# Altium schematic sheet Main_Schematic.SchDoc
size D; SheetTitle: Sheet Title
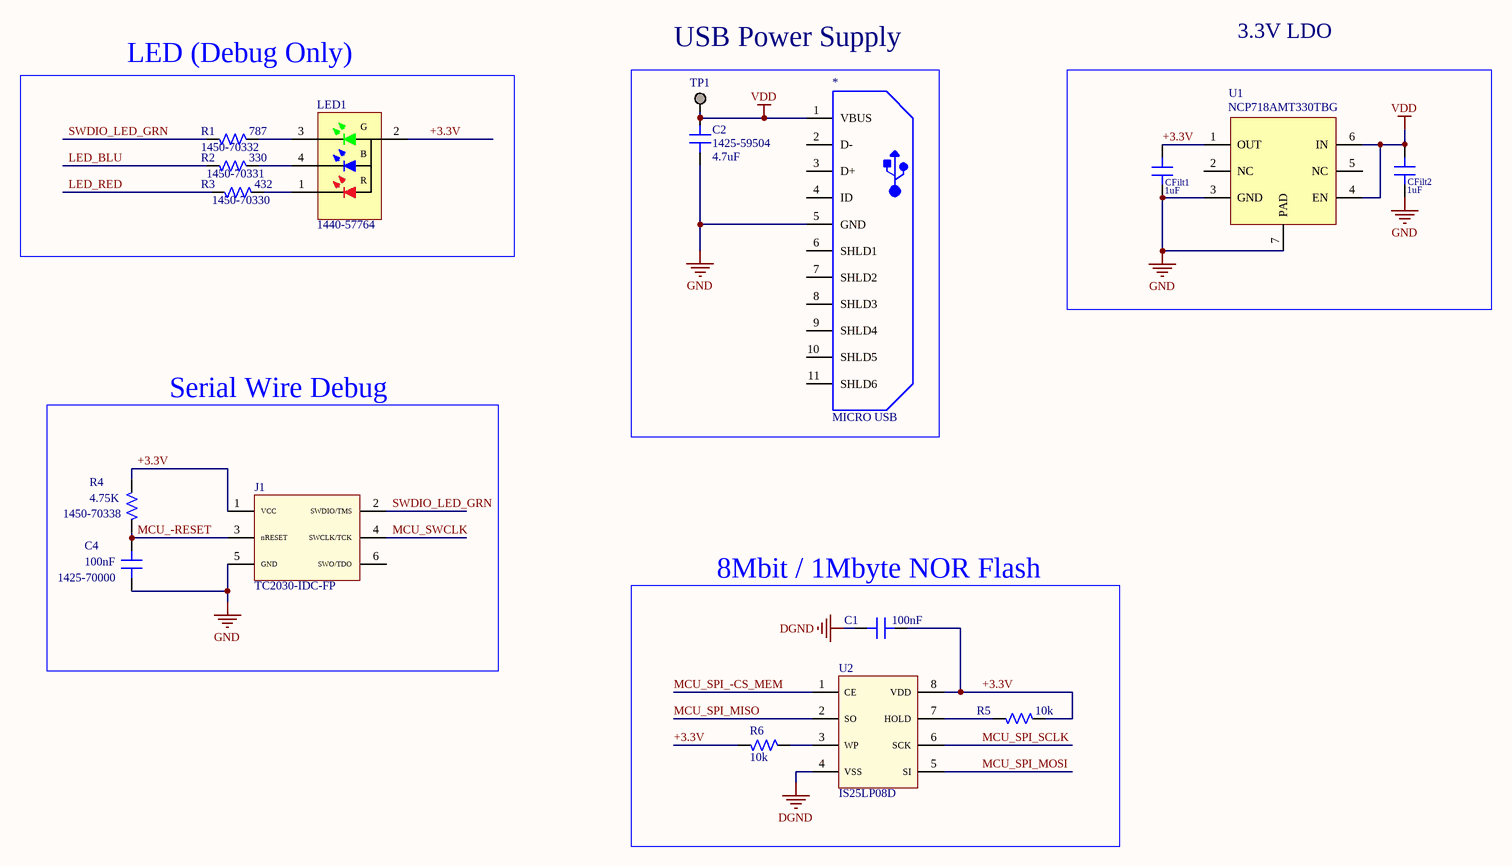
[diagram p0: Main_Schematic.SchDoc]

## Parts
*  value MICRO USB  [PCB MOUNT MICRO USB]  (hidden comment: CONN RCPT MICRO USB AB R/A SMD)
C1  value 100nF  [0402 Capacitor, IPC High]  (hidden comment: CAP CER 0.1UF 25V X7R 0402)
C2  value 4.7uF  Rockford Part Number: 1425-59504  [0805 Capacitor, IPC High]  (hidden comment: CAP CER 4.7UF 50V X5R 0805)
C4  value 100nF  Rockford Part Number: 1425-70000  [0402 Capacitor, IPC High]  (hidden comment: CAP CER 0.1UF 25V X7R 0402)
CFilt1  value 1uF  [0603 Capacitor, IPC High]  (hidden comment: CAP CER 1UF 25V X5R 0603)
CFilt2  value 1uF  [0603 Capacitor, IPC High]  (hidden comment: CAP CER 1UF 25V X5R 0603)
J1  value TC2030-IDC-FP  [TC2030-IDC 6PIN PLUG OF NAILS]  (hidden comment: TC2030-IDC PLUG-OF-NAILS)
LED1  Rockford Part Number: 1440-57764  [3X1MM RT ANGLE RGB LED SMD]  (hidden comment: 3X1MM LOW CURRENT RIGHT ANGLE RGB SMD LED)
R1  value 787  Rockford Part Number: 1450-70332  [0402 Resistor, IPC High]  (hidden comment: RES SMD 787 OHM 1% 1/16W 0402)
R2  value 330  Rockford Part Number: 1450-70331  [0402 Resistor, IPC High]  (hidden comment: RES SMD 330 OHM 1% 1/16W 040)
R3  value 432  Rockford Part Number: 1450-70330  [0402 Resistor, IPC High]  (hidden comment: RES SMD 432 OHM 1% 1/16W 0402)
R4  value 4.75K  Rockford Part Number: 1450-70338  [0402 Resistor, IPC High]  (hidden comment: RES SMD 4.75K OHM 1% 1/16W 0402)
R5  value 10k  [0402 Resistor, IPC High]  (hidden comment: RES SMD 10K OHM 1% 1/16W 0402)
R6  value 10k  [0402 Resistor, IPC High]  (hidden comment: RES SMD 10K OHM 1% 1/16W 0402)
TP1  TEST POINT~RND~1.0mm  [TEST POINT~RND~1.0mm]  (value not drawn)  (no BOM)
U1  value NCP718AMT330TBG  [SON65P200X80_HS-7N]  (hidden comment: IC REG LIN POS 3.3V 300MA LOW IQ WIDE INPUT)
U2  value IS25LP08D  [8-SOP]  (hidden comment: IC FLASH 8M SPI 133MHZ 8SOIC)

## Blocks framed on the sheet
LED (Debug Only): LED1 R1-R3
USB Power Supply: * C2 TP1
Serial Wire Debug: C4 J1 R4
8Mbit / 1Mbyte NOR Flash: C1 R5 R6 U2

## Nets
DGND: C1.2 U2.4(VSS)
GND: *.5(GND) C2.2 C4.1 CFilt1.1 CFilt2.1 J1.5(GND) U1.3(GND) U1.7(PAD)
VDD: *.1(VBUS) C2.1 CFilt2.2 TP1.1 U1.4(EN) U1.6(IN)
+3.3V: C1.1 CFilt1.2 J1.1(VCC) LED1.2(A) R4.2 R5.1 R6.1 U1.1(OUT) U2.8(VDD)
LED_BLU: R2.1
LED_RED: R3.1
MCU_-RESET: C4.2 J1.3(nRESET) R4.1
MCU_SPI_-CS_MEM: U2.1(CE)
MCU_SPI_MISO: U2.2(SO)
MCU_SPI_MOSI: U2.5(SI)
MCU_SPI_SCLK: U2.6(SCK)
MCU_SWCLK: J1.4(SWCLK/TCK)
SWDIO_LED_GRN: J1.2(SWDIO/TMS) R1.1
NetLED1_1: LED1.1(R) R3.2
NetLED1_3: LED1.3(G) R1.2
NetLED1_4: LED1.4(B) R2.2
NetR5_2: R5.2 U2.7(HOLD)
NetR6_2: R6.2 U2.3(WP)

Not connected (* = marked no-connect by the designer): * 2(D-) 3(D+) 4(ID) 6(SHLD1) 7(SHLD2) 8(SHLD3) 9(SHLD4) 10(SHLD5) 11(SHLD6); J1 6(SWO/TDO); U1 2(NC) 5(NC)

## Notes on the sheet
- 3.3V LDO
- DATE
- REVISION
- DESCRIPTION
- Engineer:
- Title:
- Sheet Title:
- Part Number:
- Rev:
- Date:
- Sheet
- Size:
- D
- of

## Library data of the parts
* = 70888-1: Rockford Part Number: 1040-70888
C1 C4 = 1425-70000-7: Tolerance: 10%
  C1: Rockford Part Number: 1425-70000
C2 = 1425-59504-8: Tolerance: 10%
CFilt1 CFilt2 = 1425-54589-11: Tolerance: 10%; Case Code (Metric): 1608; Capacitance: 1uF; Case Code (Imperial): 0603; Voltage Rating: 25V; Thickness: 0.87mm
J1 = 74346-1: Rockford Part Number: 1565-74346
LED1 = 1440-57764-7
R1 = 70332-5: Tolerance: 1%
R2 = 70331-5: Tolerance: 1%
R3 = 70330-5: Tolerance: 1%
R4 = 70338-5: Tolerance: 1%
R5 R6 = 1450-70006-3: Rockford Part Number: 1450-70006; Tolerance: 1%
TP1 = MISC-00017-1
U1 = 74165-4: Rockford Part Number: 1580-74165
U2 = 73358-1: Rockford Part Number: 1280-73358